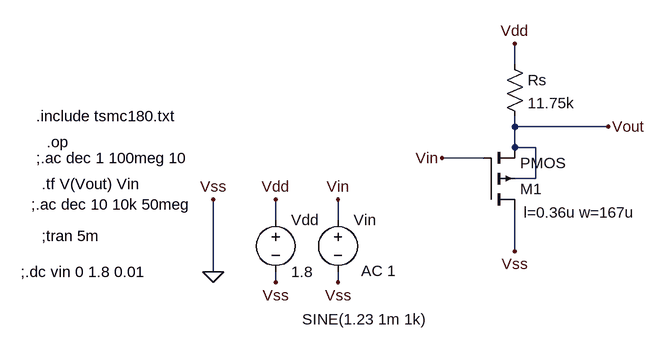
[diagram p0: schematic CD_amp_PMOS_pres.asc]
CD_amp_PMOS_pres.asc, the LTspice schematic file:
Version 4
SHEET 1 944 680
WIRE 512 -32 512 -64
WIRE 512 64 512 48
WIRE 656 64 512 64
WIRE 512 96 512 64
WIRE 544 96 512 96
WIRE 464 112 400 112
WIRE 544 144 544 96
WIRE 544 144 512 144
WIRE 144 208 144 176
WIRE 240 208 240 176
WIRE 512 256 512 192
WIRE 48 288 48 176
WIRE 144 304 144 288
WIRE 240 304 240 288
FLAG 48 288 0
FLAG 48 176 Vss
FLAG 240 176 Vin
FLAG 144 304 Vss
FLAG 240 304 Vss
FLAG 144 176 Vdd
FLAG 512 256 Vss
FLAG 656 64 Vout
FLAG 400 112 Vin
FLAG 512 -64 Vdd
SYMBOL voltage 144 192 R0
WINDOW 123 0 0 Left 0
WINDOW 39 0 0 Left 0
SYMATTR InstName Vdd
SYMATTR Value 1.8
SYMBOL voltage 240 192 R0
WINDOW 3 -55 169 Left 2
WINDOW 123 36 94 Left 2
WINDOW 39 0 0 Left 0
SYMATTR Value SINE(1.23 1m 1k)
SYMATTR Value2 AC 1
SYMATTR InstName Vin
SYMBOL pmos4 464 192 M180
WINDOW 123 62 -4 Left 2
SYMATTR InstName M1
SYMATTR Value2 l=0.36u w=167u
SYMBOL res 496 -48 R0
SYMATTR InstName Rs
SYMATTR Value 11.75k
TEXT -224 48 Left 2 !.include tsmc180.txt
TEXT -208 88 Left 2 !.op
TEXT -224 112 Left 2 !;.ac dec 1 100meg 10
TEXT -216 152 Left 2 !.tf V(Vout) Vin
TEXT -216 232 Left 2 !;tran 5m
TEXT -248 288 Left 2 !;.dc vin 0 1.8 0.01
TEXT -232 184 Left 2 !;.ac dec 10 10k 50meg

The netlist it stands for:
* CD_amp_PMOS_pres.asc
Vdd Vdd 0 1.8
Vin Vin 0 SINE(1.23 1m 1k) AC 1
M1 0 Vin Vout Vout PMOS l=0.36u w=167u
Rs Vdd Vout 11.75k
.model NMOS NMOS
.model PMOS PMOS
.lib standard.mos
.include tsmc180.txt
.op
;.ac dec 1 100meg 10
.tf V(Vout) Vin
;tran 5m
;.dc vin 0 1.8 0.01
;.ac dec 10 10k 50meg
.backanno
.end